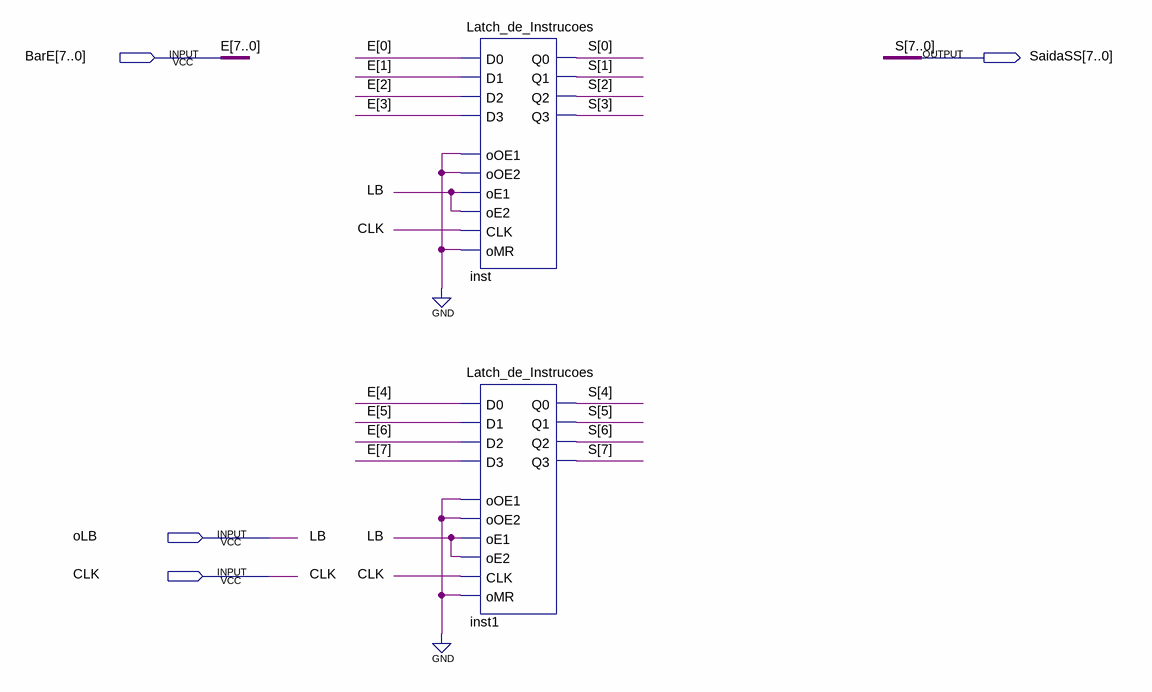
[diagram p0: schematic sheet]
// Quartus schematic Registrador_B.bdf as structural Verilog: 2 symbols, 4 pins
module Registrador_B (
  input  [7:0] BarE,
  input  oLB,
  input  CLK,
  output [7:0] SaidaSS
);

  Latch_de_Instrucoes inst (
    .D0(BarE[0]), .D1(BarE[1]), .D2(BarE[2]), .D3(BarE[3]), .oOE1(1'b0), .oOE2(1'b0), .oE1(oLB), .oE2(oLB),
    .CLK(CLK), .oMR(1'b0), .Q0(SaidaSS[0]), .Q1(SaidaSS[1]), .Q2(SaidaSS[2]), .Q3(SaidaSS[3]));
  Latch_de_Instrucoes inst1 (
    .D0(BarE[4]), .D1(BarE[5]), .D2(BarE[6]), .D3(BarE[7]), .oOE1(1'b0), .oOE2(1'b0), .oE1(oLB), .oE2(oLB),
    .CLK(CLK), .oMR(1'b0), .Q0(SaidaSS[4]), .Q1(SaidaSS[5]), .Q2(SaidaSS[6]), .Q3(SaidaSS[7]));

  // Other names for the same wires on the sheet: E[7:0] = BarE; LB = oLB; S[7:0] = SaidaSS
endmodule
